# Altium schematic sheet [4]Button.SchDoc
size B
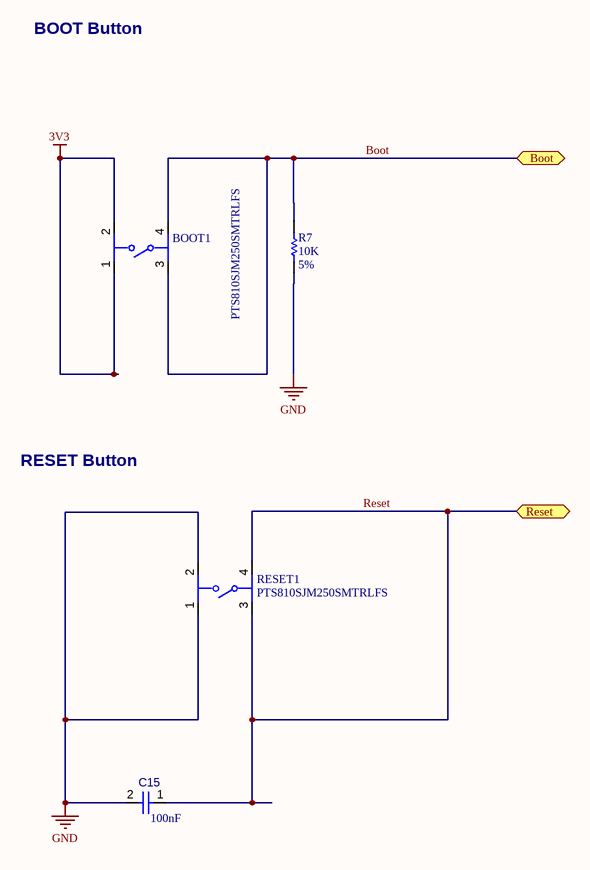
[diagram p0: [4]Button.SchDoc]

## Parts
BOOT1  PTS810SJM250SMTRLFS  [FP-PTS810SJM250SMTRLFS-MFG]
C15  value 100nF  [CAPC1608X90X40ML10T20]  (hidden comment: Capacitor 100 nF +/-10% 50 V 0603)
R7  value 10K  Tolerance: 5%  [RES 0603]  (hidden comment: RES 10K 5% 0.1W [0603])
RESET1  PTS810SJM250SMTRLFS  [FP-PTS810SJM250SMTRLFS-MFG]

## Ports
Boot (bidir), Reset (bidir)

## Nets
3V3: BOOT1.1 BOOT1.2
GND: C15.2 R7.1 RESET1.1 RESET1.2
Boot: BOOT1.3 BOOT1.4 R7.2 ; port Boot
Reset: C15.1 RESET1.3 RESET1.4 ; port Reset

## Notes on the sheet
- BOOT Button
- RESET Button
- 8
- 7
- 6
- 5
- 4
- 3
- DWG. NO.
- REV.
- SHT.
- REVISION
- 2
- DESCRIPTION
- DATE
- 1
- APPROVED
- THIS DOCUMENT AND THE DATA DISCLOSED HEREIN OR HEREWITH IS THE PROPERTY OF ALTIUM LIMITED AND MAY BE FREELY DISTRIBUTED IN WHOLE. NO RIGHTS ARE RESERVED OR EXPRESS OR IMPLIED WARANTEE GIVEN.
- F
- E
- D
- C
- B
- A
- SCALE:
- A3
- SIZE
- CAGE CODE
- FILE NAME
- DWG NO.
- SHEET
- OF
- REV

## Library data of the parts
BOOT1 RESET1 = Button: SWITCH TACTILE SPST-NO 0.05A 16V; Manufacturer: C&K Components; Throw Configuration: SPST; Contact Resistance: 500mΩ; Electromechanical Life: 150000Cycles; Operating Force: 160gf; Contact Current Rating: 50mA; Temperature: -40°C to +85°C; Device Class L2: Switches; Digikey Description: SWITCH TACTILE SPST-NO 0.05A 16V; Automotive: No; Height: 2.7mm; ComponentLink2Description: Datasheet; Temperature Range Low: -40°C; Device Class L1: Electromechanical; Mouser Description: Switch Tactile N.O. SPST Button J-Bend 0.05A 16VDC 150000Cycles 1.57N SMD T/R; Octopart: https://octopart.com/pts810+sjm+250+smtr+lfs-c%26k+components-29687929; Lead Free: Yes; Voltage Rating Dc: 16V; Temperature Range High: +85°C; Package: PTS810SJM250SMTRLFS; Manufacturer Part Number: PTS810SJM250SMTRLFS; ComponentLink2URL: https://www.ckswitches.com/media/1476/pts810.pdf; Category: Switch; RoHS: TRUE; Device Class L3: Tactile Switches
C15 = CMP-001-00017-4: Chip Capacitor, 100 nF, +/- 10%, 50 V, 0603 (1608 Metric); Capacitor Type: Ceramic; Voltage Rating: 50V; RoHS Compliant: True; Max Operating Temperature: 125°C; Pins: 2; Mounting Technology: SM; Min Operating Temperature: -55°C; Tolerance: 10%; Case/Package: 0603
R7 = RES 10K 5% 0.1W [0603]: PN: CR0603-JW-103ELF; Supplier 1: Newark; Supplier Part Number 1: 84W7243